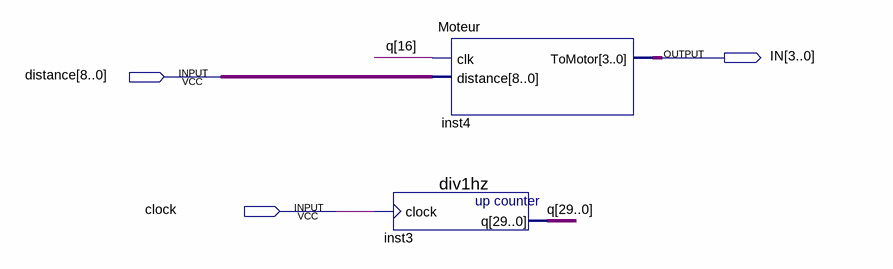
[diagram p0: schematic sheet]
// Quartus schematic Test_moteur.bdf as structural Verilog: 2 symbols, 3 pins
module Test_moteur (
  input  [8:0] distance,
  input  clock,
  output [3:0] IN
);

  wire [29:0] q;

  div1hz inst3 (.clock(clock), .q(q));
  Moteur inst4 (.clk(q[16]), .distance(distance), .ToMotor(IN));
endmodule
